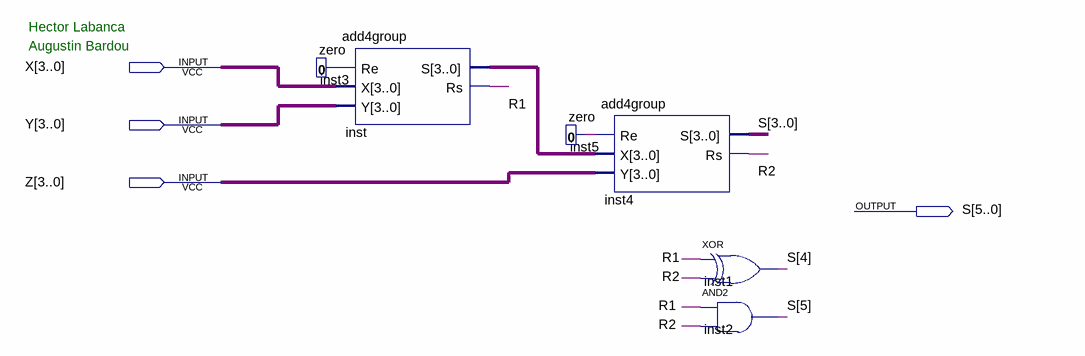
[diagram p0: schematic sheet]
// Quartus schematic ADD3.bdf as structural Verilog: 6 symbols, 4 pins
module ADD3 (
  input  [3:0] X,
  input  [3:0] Y,
  input  [3:0] Z,
  output [5:0] S
);

  wire inst3_0, inst5_0, R1, R2;
  wire [3:0] inst_s;

  add4group inst (.Re(inst3_0), .X(X), .Y(Y), .S(inst_s), .Rs(R1));
  zero inst3 (.\0 (inst3_0));
  zero inst5 (.\0 (inst5_0));
  add4group inst4 (.Re(inst5_0), .X(inst_s), .Y(Z), .S(S[3:0]), .Rs(R2));
  xor inst1 (S[4], R1, R2);
  and inst2 (S[5], R1, R2);

  // Notes on the sheet:
  //   Hector Labanca
  //   Augustin Bardou
endmodule
